# EAGLE schematic fabscope (EAGLE 6.5.0)
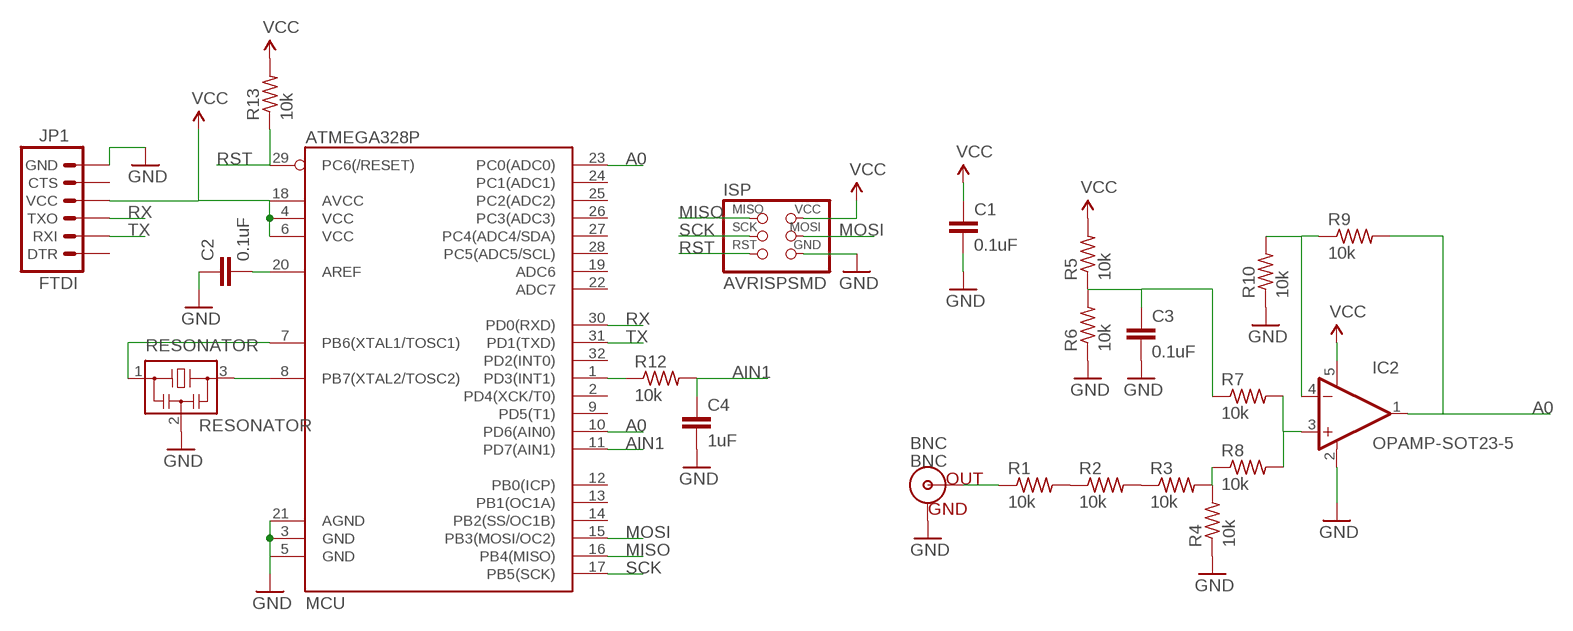
[diagram p0: schematic, sheet 1]

## Parts
BNC  BNC  BNCPTH  [BNC]
C1  0.1uF  CAPACITOR1206FAB  [C1206FAB]
C2  0.1uF  CAPACITOR1206FAB  [C1206FAB]
C3  0.1uF  CAPACITOR1206FAB  [C1206FAB]
C4  1uF  CAPACITOR1206FAB  [C1206FAB]
IC2  OPAMP-SOT23-5  [SOT23-5]
ISP  AVRISPSMD  [2X3SMD]
JP1  FTDI  FTDI-SMD  [FTDI-SMD]
MCU  ATMEGA328P  ATMEGA328_SMT  [TQFP32-08]
R1  10k  RES-US1206FAB  [R1206FAB]
R2  10k  RES-US1206FAB  [R1206FAB]
R3  10k  RES-US1206FAB  [R1206FAB]
R4  10k  RES-US1206FAB  [R1206FAB]
R5  10k  RES-US1206FAB  [R1206FAB]
R6  10k  RES-US1206FAB  [R1206FAB]
R7  10k  RES-US1206FAB  [R1206FAB]
R8  10k  RES-US1206FAB  [R1206FAB]
R9  10k  RES-US1206FAB  [R1206FAB]
R10  10k  RES-US1206FAB  [R1206FAB]
R12  10k  RES-US1206FAB  [R1206FAB]
R13  10k  RESISTOR1206FAB  [R1206FAB]
RESONATOR  RESONATOR  [EFOBM]

## Nets
A0: IC2.1(OUT) MCU.10(PD6(AIN0)) MCU.23(PC0(ADC0)) R9.2
AIN1: C4.1 MCU.11(PD7(AIN1)) R12.2
GND: BNC.GND C1.2 C2.1 C3.2 C4.2 IC2.2(V-) ISP.6(GND) JP1.6(GND) MCU.3(GND) MCU.5(GND) MCU.21(AGND) R4.1 R6.1 R10.1 RESONATOR.2
MISO: ISP.1(MISO) MCU.16(PB4(MISO))
MOSI: ISP.4(MOSI) MCU.15(PB3(MOSI/OC2))
N$1: MCU.7(PB6(XTAL1/TOSC1)) RESONATOR.1
N$2: MCU.8(PB7(XTAL2/TOSC2)) RESONATOR.3
N$3: BNC.S(OUT) R1.1
N$4: C2.2 MCU.20(AREF)
N$5: R1.2 R2.1
N$6: R2.2 R3.1
N$7: R3.2 R4.2 R8.1
N$9: C3.1 R5.1 R6.2 R7.1
N$10: IC2.3(+IN) R7.2 R8.2
N$11: IC2.4(-IN) R9.1 R10.2
N$12: MCU.1(PD3(INT1)) R12.1
RST: ISP.5(RST) MCU.29(PC6(/RESET)) R13.1
RX: JP1.3(TXO) MCU.30(PD0(RXD))
SCK: ISP.3(SCK) MCU.17(PB5(SCK))
TX: JP1.2(RXI) MCU.31(PD1(TXD))
VCC: C1.1 IC2.5(V+) ISP.2(VCC) JP1.4(VCC) MCU.4(VCC) MCU.6(VCC) MCU.18(AVCC) R5.2 R13.2
Unconnected: JP1.1(DTR) JP1.5(CTS) MCU.2(PD4(XCK/T0)) MCU.9(PD5(T1)) MCU.12(PB0(ICP)) MCU.13(PB1(OC1A)) MCU.14(PB2(SS/OC1B)) MCU.19(ADC6) MCU.22(ADC7) MCU.24(PC1(ADC1)) MCU.25(PC2(ADC2)) MCU.26(PC3(ADC3)) MCU.27(PC4(ADC4/SDA)) MCU.28(PC5(ADC5/SCL)) MCU.32(PD2(INT0))

## Library data of the parts
BNC = SparkFun-Connectors:BNC: BNC Connector, Mouser Part# 5227161
C1-C3 = fab:CAPACITOR
C4 = fab:CAPACITOR; VALUE: 0.1uF
IC2 = fab:OPAMP
ISP = fab:AVRISP
JP1 = fab:FTDI
MCU = SparkFun-DigitalIC:ATMEGA328_SMT: 32-Pin Atmega328 part Commonly used on Arduino compatible boards Available in QFP and QFN packages TQFP is IC-09069 QFN is non-stock; PROD_ID: IC-09069
R1-R10 R12 = fab:RES-US: Resistor (US Symbol) Variants with postfix FAB are widened to allow the routing of internal traces
R13 = fab:RESISTOR
RESONATOR = fab:RESONATOR